# Altium schematic sheet INV.ControlMCU.SchDoc
size A0; SheetNumber: 3; SheetTotal: 3
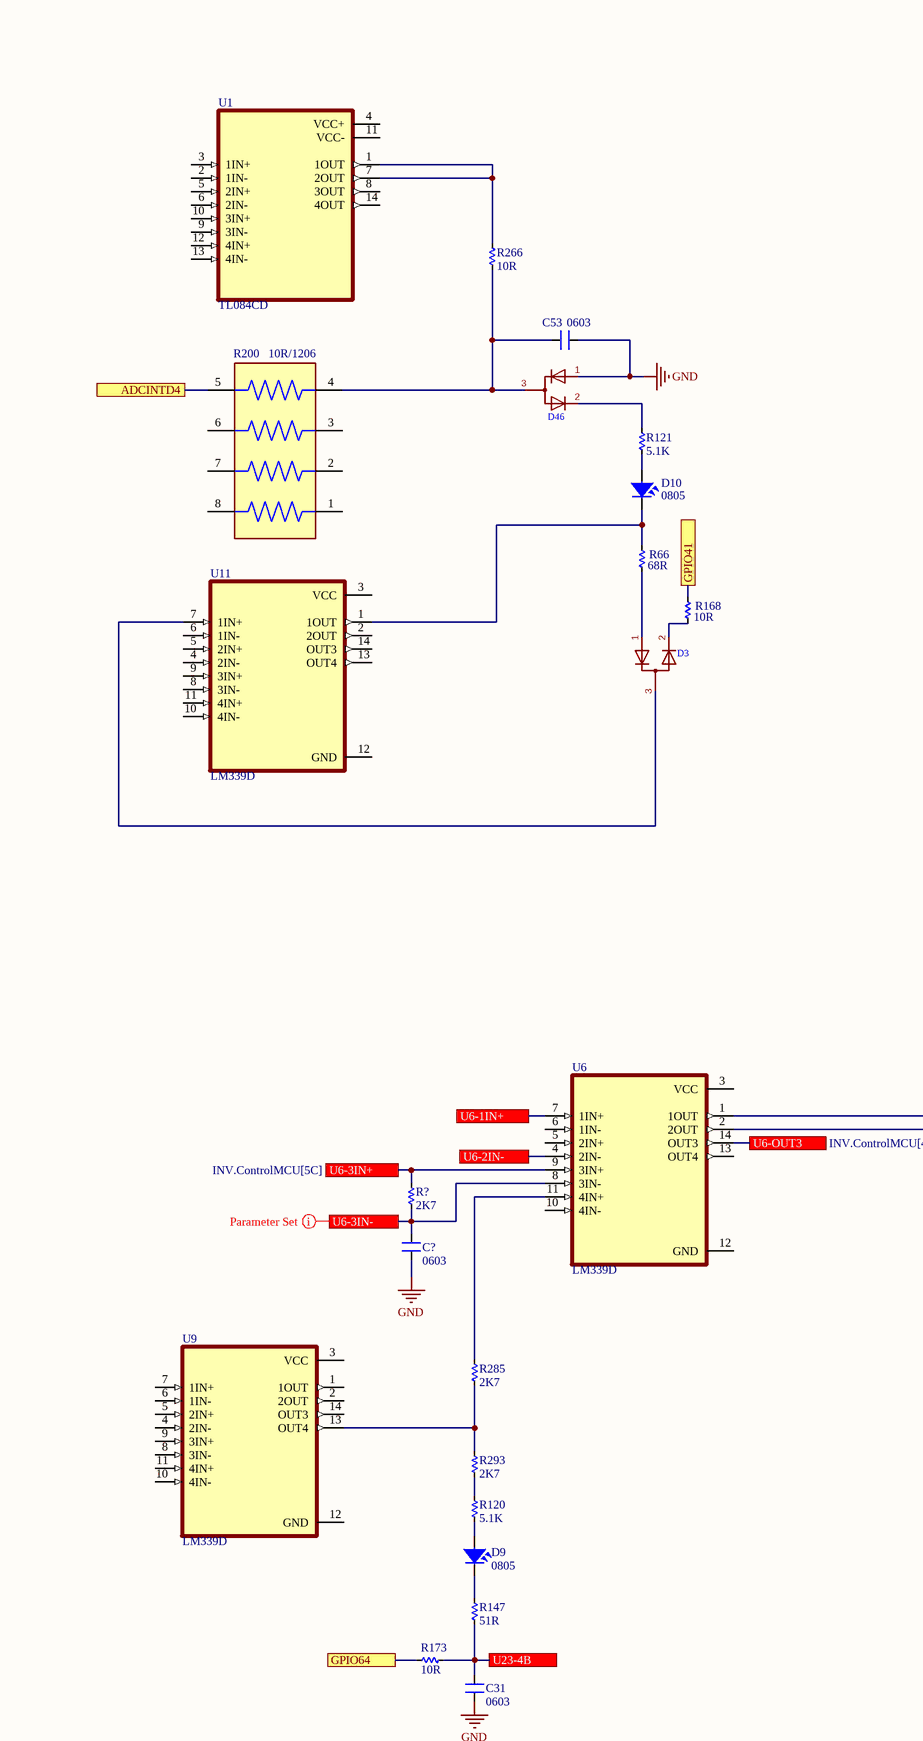
[diagram p0: INV.ControlMCU.SchDoc, top left]
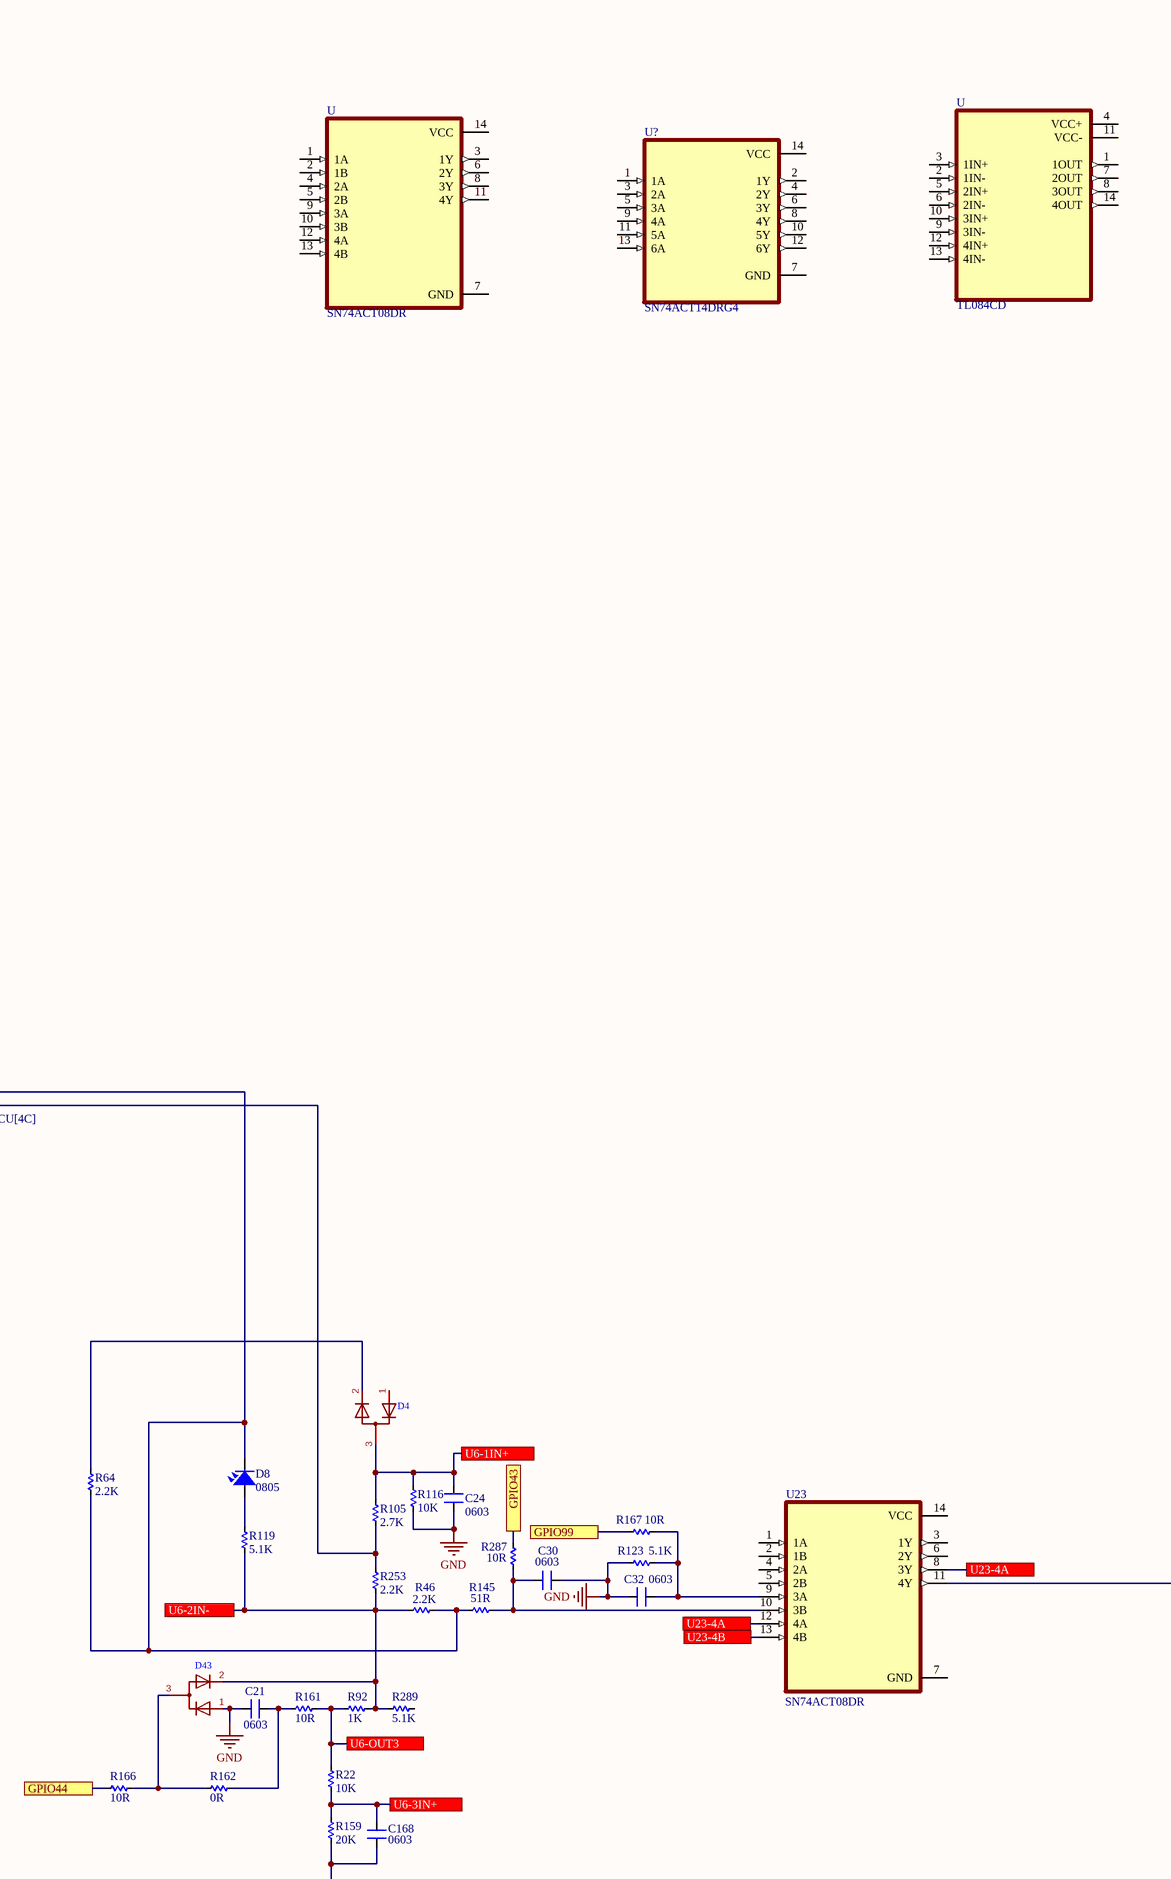
[diagram p1: INV.ControlMCU.SchDoc, top middle]
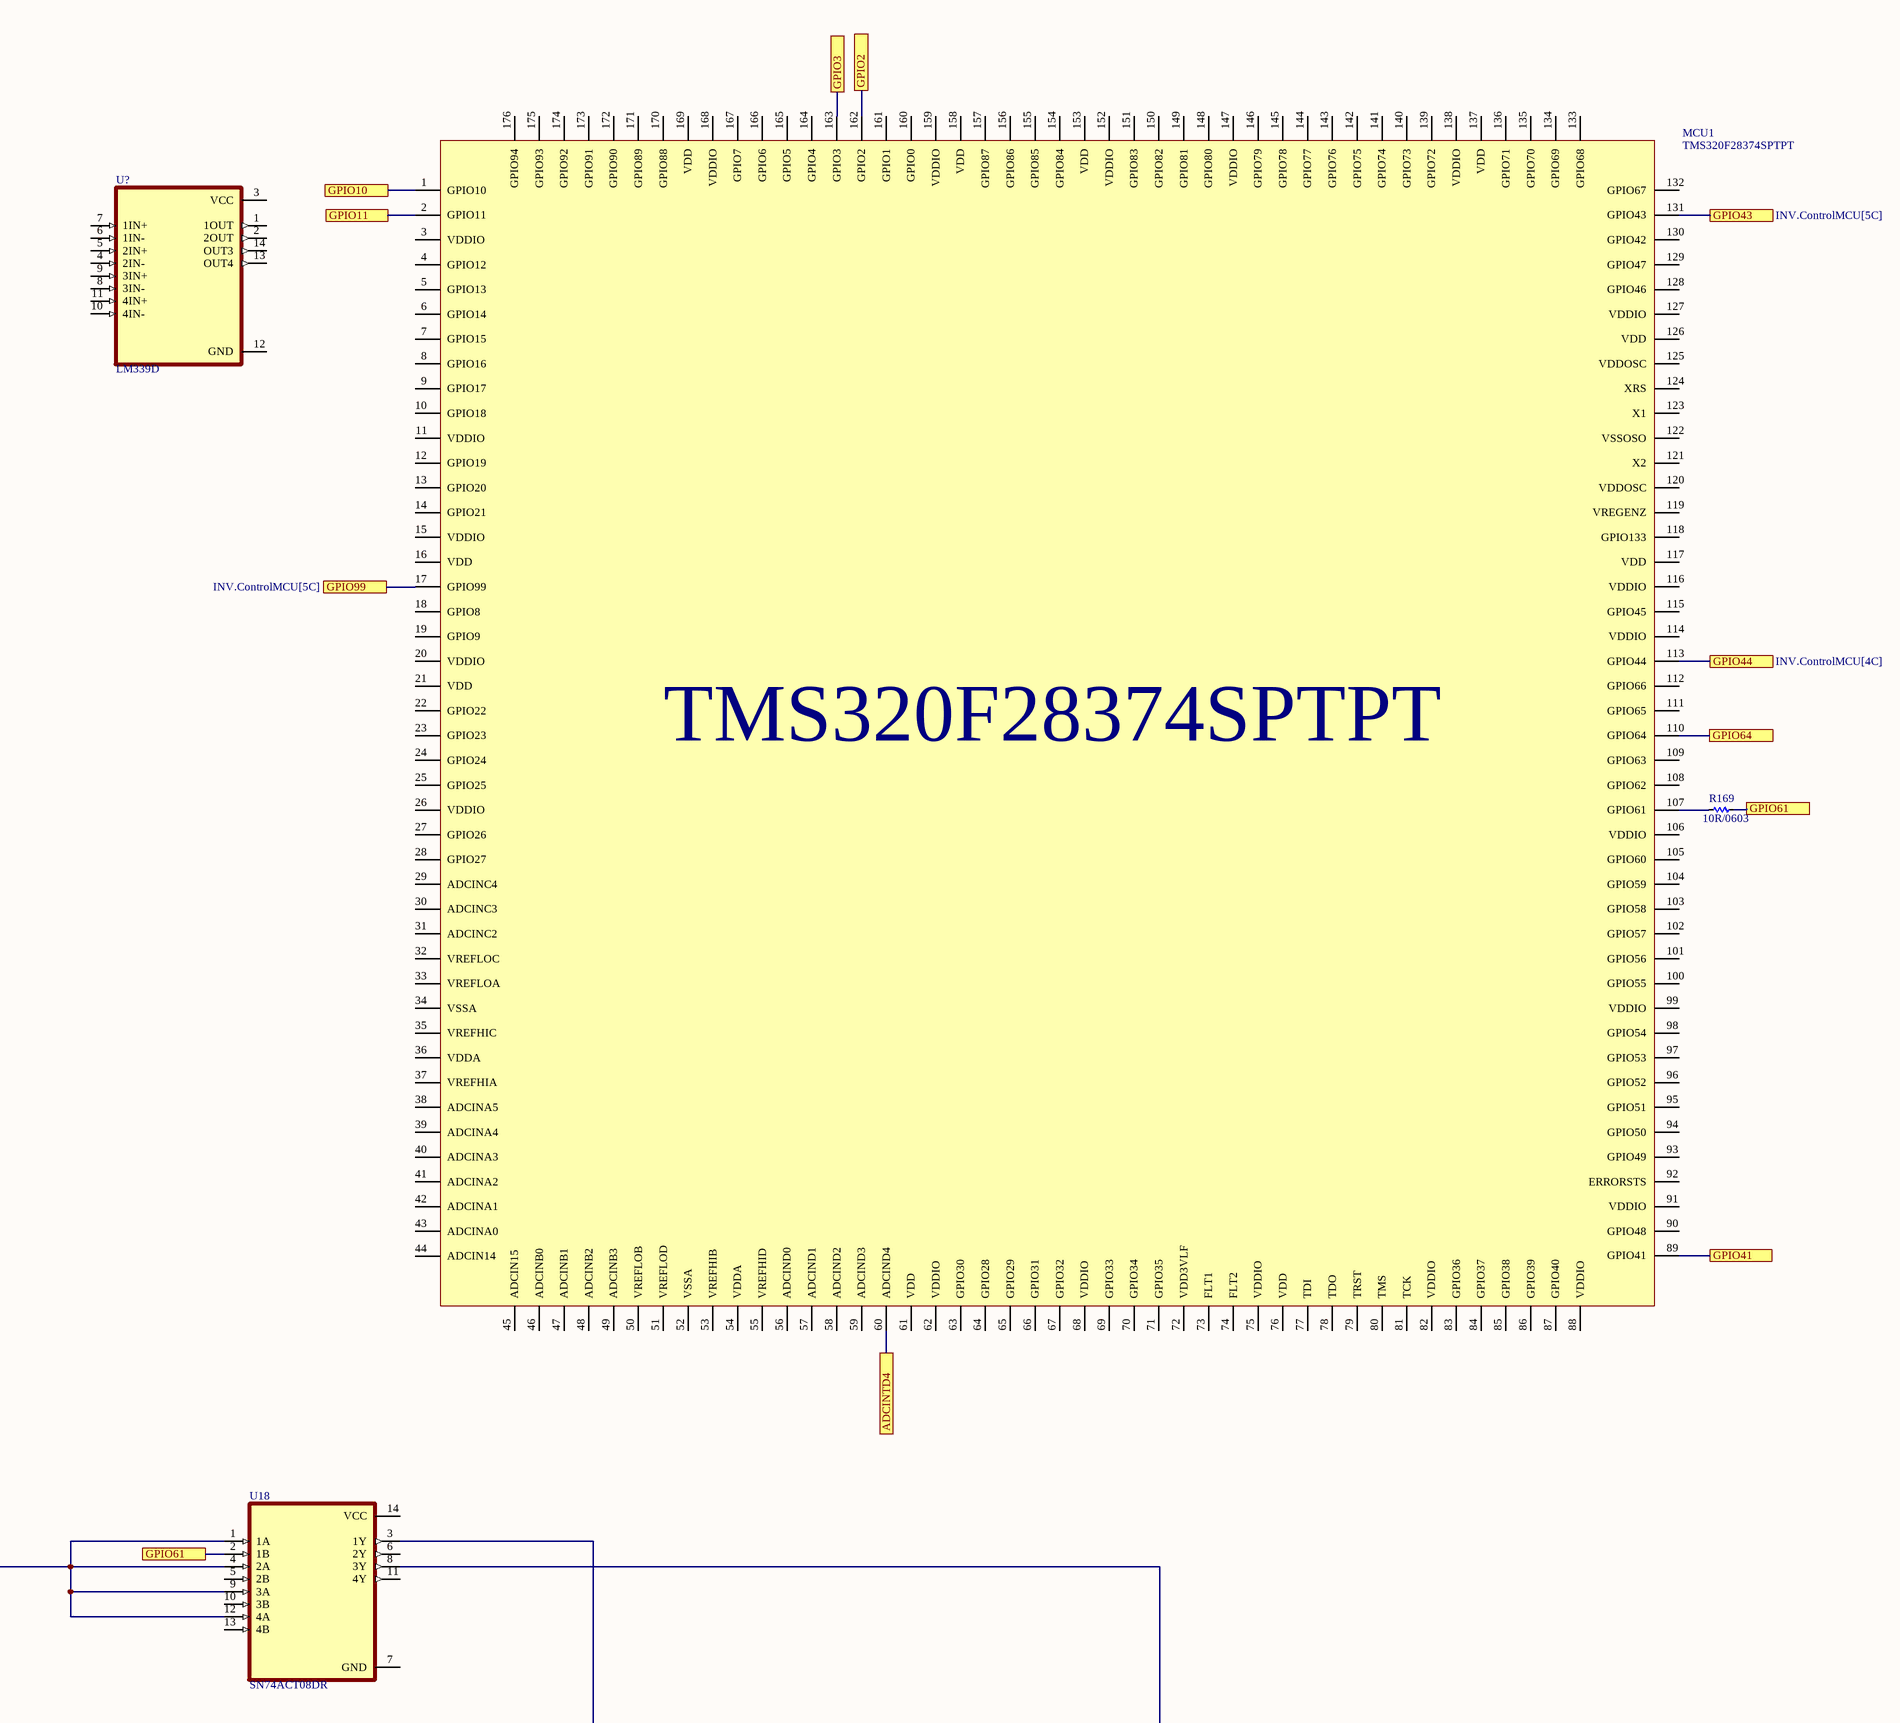
[diagram p2: INV.ControlMCU.SchDoc, top right]
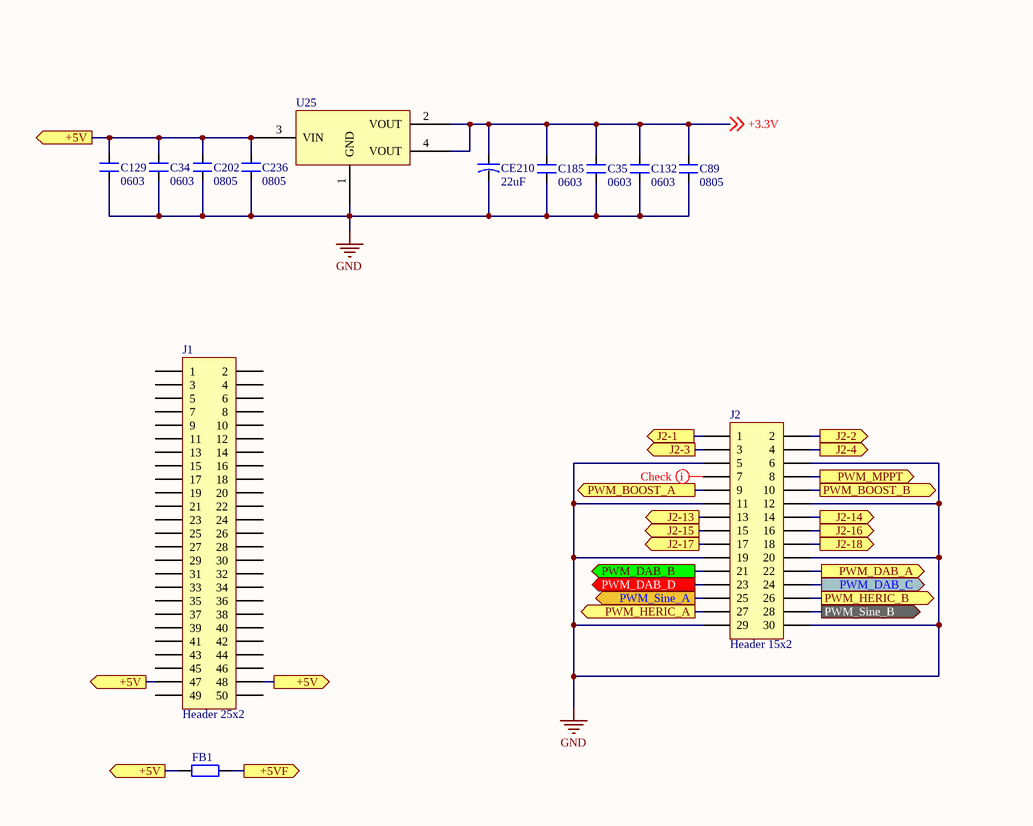
[diagram p3: INV.ControlMCU.SchDoc, bottom left]
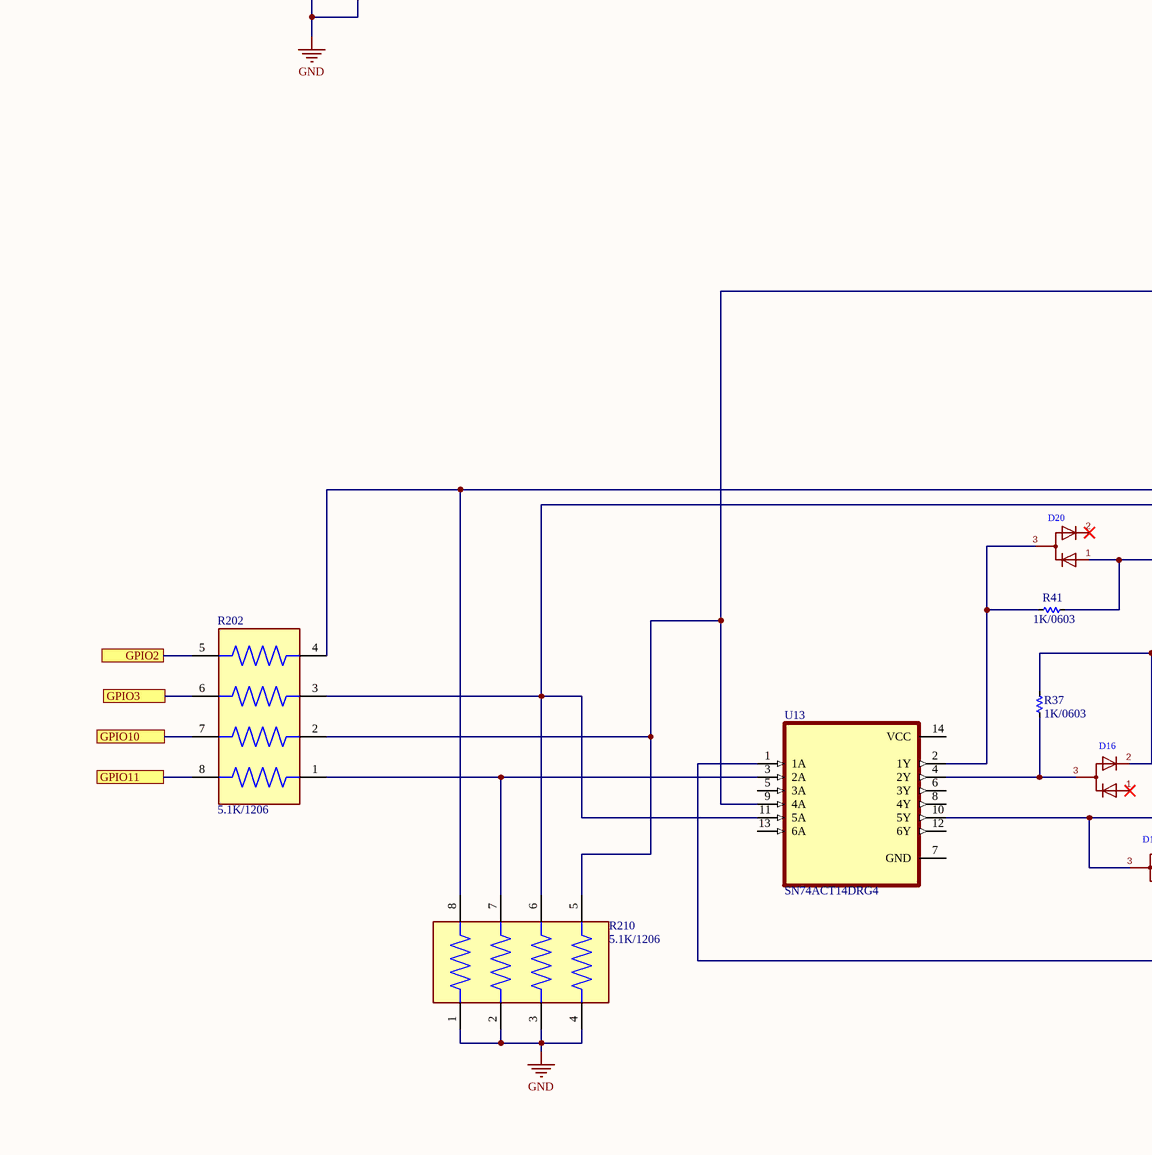
[diagram p4: INV.ControlMCU.SchDoc, bottom middle]
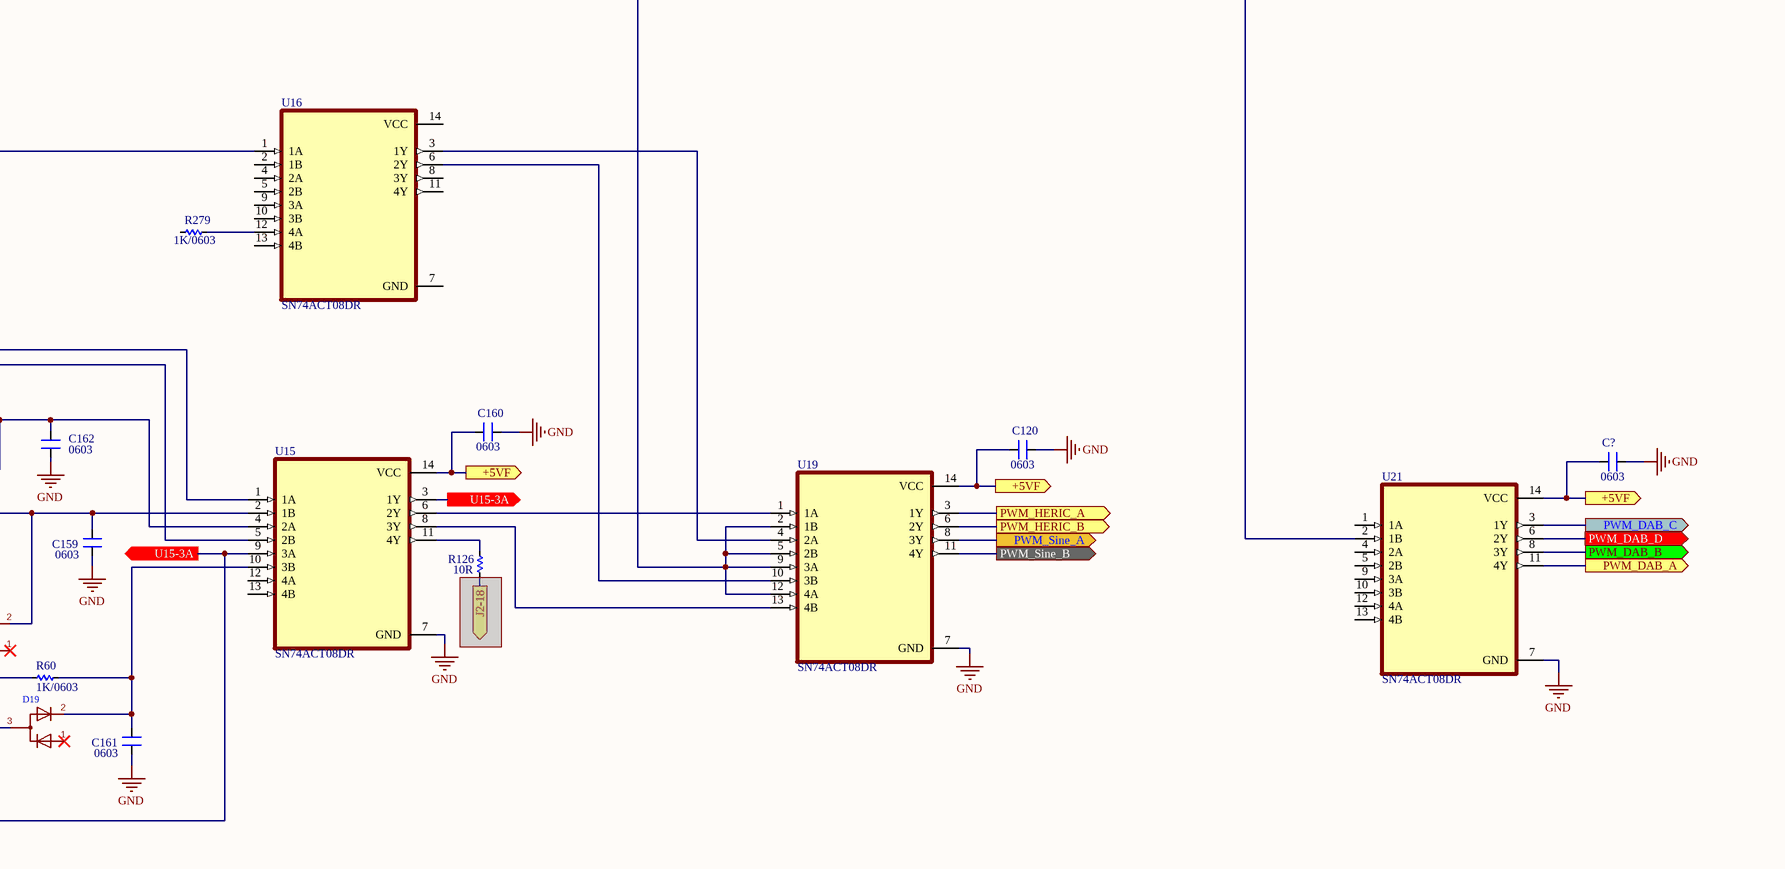
[diagram p5: INV.ControlMCU.SchDoc, bottom right]

## Parts
(Parts that share a designator on the sheet are numbered #1, #2 ... from top to bottom, then left to right.)
C21  0603  [CAP-SMD-0805 EX]
C24  0603  [CAP-SMD-0805 EX]
C30  0603  [CAP-SMD-0805 EX]
C31  0603  [CAP-SMD-0805 EX]
C32  0603  [CAP-SMD-0805 EX]
C34  0603  [CAP-SMD-0805 EX]
C35  0603  [CAP-SMD-0805 EX]
C53  0603  [CAP-SMD-0805 EX]
C89  0805  [CAP-SMD-0805 EX]
C120  0603  [CAP-SMD-0805 EX]
C129  0603  [CAP-SMD-0805 EX]
C132  0603  [CAP-SMD-0805 EX]
C159  0603  [CAP-SMD-0805 EX]
C160  0603  [CAP-SMD-0805 EX]
C161  0603  [CAP-SMD-0805 EX]
C162  0603  [CAP-SMD-0805 EX]
C168  0603  [CAP-SMD-0805 EX]
C185  0603  [CAP-SMD-0805 EX]
C202  0805  [CAP-SMD-0805 EX]
C236  0805  [CAP-SMD-0805 EX]
C?#1  0603  [CAP-SMD-0805 EX]
C?#2  0603  [CAP-SMD-0805 EX]
CE210  22uF  [CAP-ALU-SMD-4]
D3  Dual-Diode_CA_1  [SOT-23]  (value not drawn)
D4  Dual-Diode_CA_1  [SOT-23]  (value not drawn)
D8  0805  [LED 3512]
D9  0805  [LED 3512]
D10  0805  [LED 3512]
D16  Dual-Diode_CA_1  [SOT-23]  (value not drawn)
D19  Dual-Diode_CA_1  [SOT-23]  (value not drawn)
D20  Dual-Diode_CA_1  [SOT-23]  (value not drawn)
D43  Dual-Diode_CA_1  [SOT-23]  (value not drawn)
D46  Dual-Diode_CA_1  [SOT-23]  (value not drawn)
FB1  (no value)  [RESC-0603 (1608)]
J1  Header 25x2  [Head 1X16 - CAI THANG]
J2  Header 15x2  [Head 1X16 - CAI THANG]
MCU1  TMS320F28374SPTPT
R22  10K  [RES-SMD-0603 EX]
R37  1K/0603  [RES-SMD-0603]
R41  1K/0603  [RES-SMD-0603]
R46  2.2K  [RES-SMD-0603 EX]
R60  1K/0603  [RES-SMD-0603]
R64  2.2K  [RES-SMD-0603 EX]
R66  68R  [RES-SMD-0603 EX]
R92  1K  [RES-SMD-0603 EX]
R105  2.7K  [RES-SMD-0603 EX]
R116  10K  [RES-SMD-0603 EX]
R119  5.1K  [RES-SMD-0603 EX]
R120  5.1K  [RES-SMD-0603 EX]
R121  5.1K  [RES-SMD-0603 EX]
R123  5.1K  [RES-SMD-0603 EX]
R126  10R  [RES-1/2W]
R145  51R  [RES-SMD-0603 EX]
R147  51R  [RES-SMD-0603 EX]
R159  20K  [RES-SMD-0603 EX]
R161  10R  [RES-SMD-0603 EX]
R162  0R  [RES-SMD-0603 EX]
R166  10R  [RES-SMD-0603 EX]
R167  10R  [RES-SMD-0603 EX]
R168  10R  [RES-SMD-0603 EX]
R169  10R/0603  [RES-SMD-0603 EX]
R173  10R  [RES-SMD-0603 EX]
R200  10R/1206  [RESCAXS80P320X150X55-8N]
R202  5.1K/1206  [RESCAXS80P320X150X55-8N]
R210  5.1K/1206  [RESCAXS80P320X150X55-8N]
R253  2.2K  [RES-SMD-0603 EX]
R266  10R  [RES-SMD-0603 EX]
R279  1K/0603  [RES-SMD-0603]
R285  2K7  [RES-SMD-0603 EX]
R287  10R  [RES-SMD-0603 EX]
R289  5.1K  [RES-SMD-0603 EX]
R293  2K7  [RES-SMD-0603 EX]
R?  2K7  [RES-SMD-0603 EX]
U1  TL084CD  [SOIC127P600X175-14N]
U6  LM339D  [SOIC127P600X175-14N]
U9  LM339D  [SOIC127P600X175-14N]
U11  LM339D  [SOIC127P600X175-14N]
U13  SN74ACT14DRG4  [SOIC127P600X175-14N]
U15  SN74ACT08DR  [SOIC127P600X175-14N]
U16  SN74ACT08DR  [SOIC127P600X175-14N]
U18  SN74ACT08DR  [SOIC127P600X175-14N]
U19  SN74ACT08DR  [SOIC127P600X175-14N]
U21  SN74ACT08DR  [SOIC127P600X175-14N]
U23  SN74ACT08DR  [SOIC127P600X175-14N]
U25  LM1117B  [SOT223]  (value not drawn)
U#1  TL084CD  [SOIC127P600X175-14N]
U#2  SN74ACT08DR  [SOIC127P600X175-14N]
U?#1  LM339D  [SOIC127P600X175-14N]
U?#2  SN74ACT14DRG4  [SOIC127P600X175-14N]

## Ports
+5V (out, see INV.ControlMCU[1D], INV.Main[1D], INV.Main[3A], INV.Main[3D], INV.Main[4A], INV.Power[1D], INV.Power[6C]), +5VF (out, see INV.ControlMCU[1D], INV.ControlMCU[8C], INV.ControlMCU[9C], INV.Main[1D], INV.Main[3D]), +5VF (out, see INV.ControlMCU[1D], INV.ControlMCU[8C], INV.ControlMCU[11C], INV.Main[1D], INV.Main[3D]), +5VF (out, see INV.ControlMCU[1D], INV.ControlMCU[9C], INV.ControlMCU[11C], INV.Main[1D], INV.Main[3D]), +5VF (out, see INV.ControlMCU[8C], INV.ControlMCU[9C], INV.ControlMCU[11C], INV.Main[1D], INV.Main[3D]), ADCINTD4 (see INV.ControlMCU[1A]), ADCINTD4 (see INV.ControlMCU[9B]), GPIO2 (see INV.ControlMCU[4C]), GPIO2 (see INV.ControlMCU[9A]), GPIO3 (see INV.ControlMCU[4D]), GPIO3 (see INV.ControlMCU[9A]), GPIO10 (see INV.ControlMCU[4D]), GPIO10 (see INV.ControlMCU[7A]), GPIO11 (see INV.ControlMCU[4D]), GPIO11 (see INV.ControlMCU[7A]), GPIO41 (see INV.ControlMCU[3B]), GPIO41 (see INV.ControlMCU[11B]), GPIO43 (see INV.ControlMCU[5C]), GPIO43 (see INV.ControlMCU[11A]), GPIO44 (see INV.ControlMCU[4C]), GPIO44 (see INV.ControlMCU[11B]), GPIO61 (see INV.ControlMCU[7C]), GPIO61 (see INV.ControlMCU[11B]), GPIO64 (see INV.ControlMCU[2C]), GPIO64 (see INV.ControlMCU[11B]), GPIO99 (see INV.ControlMCU[5C]), GPIO99 (see INV.ControlMCU[7B]), J2-1 (out, see INV.Main[1D]), J2-2 (out, see INV.Main[1D]), J2-3 (out, see INV.Main[1D]), J2-4 (out, see INV.Main[1D]), J2-13 (out, see INV.Main[1D]), J2-14 (out, see INV.Main[1D]), J2-15 (out, see INV.Main[1D]), J2-16 (out, see INV.Main[1D]), J2-17 (out, see INV.Main[1D]), J2-18 (out, see INV.ControlMCU[3D], INV.Main[1D]), J2-18 (out, see INV.Main[1D]), PWM_BOOST_A (out, see INV.Main[1D], INV.Main[2B]), PWM_BOOST_B (out, see INV.Main[1D], INV.Main[3B]), PWM_DAB_A (out, see INV.ControlMCU[3D], INV.Main[1B], INV.Main[1D]), PWM_DAB_A (out, see INV.ControlMCU[11D], INV.Main[1B], INV.Main[1D]), PWM_DAB_B (out, see INV.ControlMCU[2D], INV.Main[1B], INV.Main[1D]), PWM_DAB_B (out, see INV.ControlMCU[11C], INV.Main[1B], INV.Main[1D]), PWM_DAB_C (out, see INV.ControlMCU[3D], INV.Main[1D], INV.Main[2B]), PWM_DAB_C (out, see INV.ControlMCU[11C], INV.Main[1D], INV.Main[2B]), PWM_DAB_D (out, see INV.ControlMCU[2D], INV.Main[1D], INV.Main[2B]), PWM_DAB_D (out, see INV.ControlMCU[11C], INV.Main[1D], INV.Main[2B]), PWM_HERIC_A (out, see INV.ControlMCU[2D], INV.Main[1D], INV.Main[4B]), PWM_HERIC_A (out, see INV.ControlMCU[9C], INV.Main[1D], INV.Main[4B]), PWM_HERIC_B (out, see INV.ControlMCU[3D], INV.Main[1D], INV.Main[4B]), PWM_HERIC_B (out, see INV.ControlMCU[9C], INV.Main[1D], INV.Main[4B]), PWM_MPPT (out, see INV.Main[1D], INV.Main[4D]), PWM_Sine_A (out, see INV.ControlMCU[2D], INV.Main[1D], INV.Main[3B]), PWM_Sine_A (out, see INV.ControlMCU[9C], INV.Main[1D], INV.Main[3B]), PWM_Sine_B (out, see INV.ControlMCU[3D], INV.Main[1D], INV.Main[3B]), PWM_Sine_B (out, see INV.ControlMCU[9D], INV.Main[1D], INV.Main[3B]), U6-1IN+ (see INV.ControlMCU[2B]), U6-1IN+ (see INV.ControlMCU[5B]), U6-2IN- (see INV.ControlMCU[2B]), U6-2IN- (see INV.ControlMCU[4C]), U6-3IN+ (see INV.ControlMCU[2B]), U6-3IN+ (see INV.ControlMCU[5C]), U6-3IN-, U6-OUT3 (see INV.ControlMCU[3B]), U6-OUT3 (see INV.ControlMCU[4C]), U15-3A (out, see INV.ControlMCU[7D]), U15-3A (out, see INV.ControlMCU[8C]), U23-4A (see INV.ControlMCU[5C]), U23-4A (see INV.ControlMCU[6C]), U23-4B (see INV.ControlMCU[2C]), U23-4B (see INV.ControlMCU[5C])

## Nets
GND: C21.2 C24.2 C30.1 C31.1 C32.2 C34.1 C35.1 C53.1 C89.1 C120.1 C129.1 C132.1 C159.1 C160.1 C161.1 C162.1 C168.2 C185.1 C202.1 C236.1 C?#1.1 C?#2.1 CE210.2 D43.1(C) D46.1(C) J2.5 J2.6 J2.11 J2.12 J2.19 J2.20 J2.29 J2.30 R116.1 R123.2 R159.1 R210.1 R210.2 R210.3 R210.4 U15.7(GND) U19.7(GND) U21.7(GND) U25.1(GND)
+3.3V: C35.2 C89.2 C132.2 C185.2 CE210.1 U25.2(VOUT) U25.4(VOUT) ; off-sheet +3.3V
+5V: C34.2 C129.2 C202.2 C236.2 FB1.1 J1.47 J1.48 U25.3(VIN) ; port +5V
+5VF: C120.2 C160.2 C?#2.2 FB1.2 U15.14(VCC) U19.14(VCC) U21.14(VCC) ; port +5VF
ADCINTD4: MCU1.60(ADCIND4) R200.5 ; port ADCINTD4
GPIO2: MCU1.162(GPIO2) R202.5 ; port GPIO2
GPIO3: MCU1.163(GPIO3) R202.6 ; port GPIO3
GPIO10: MCU1.1(GPIO10) R202.7 ; port GPIO10
GPIO11: MCU1.2(GPIO11) R202.8 ; port GPIO11
GPIO41: MCU1.89(GPIO41) R168.1 ; port GPIO41
GPIO43: MCU1.131(GPIO43) R287.2 ; port GPIO43
GPIO44: MCU1.113(GPIO44) R166.1 ; port GPIO44
GPIO61: R169.1 U18.2(1B) ; port GPIO61
GPIO64: MCU1.110(GPIO64) R173.2 ; port GPIO64
GPIO99: MCU1.17(GPIO99) R167.2 ; port GPIO99
J2-1: J2.1 ; port J2-1
J2-2: J2.2 ; port J2-2
J2-3: J2.3 ; port J2-3
J2-4: J2.4 ; port J2-4
J2-13: J2.13 ; port J2-13
J2-14: J2.14 ; port J2-14
J2-15: J2.15 ; port J2-15
J2-16: J2.16 ; port J2-16
J2-17: J2.17 ; port J2-17
J2-18: J2.18 ; port J2-18
PWM_BOOST_A: J2.9 ; port PWM_BOOST_A
PWM_BOOST_B: J2.10 ; port PWM_BOOST_B
PWM_DAB_A: J2.22 U21.11(4Y) ; port PWM_DAB_A
PWM_DAB_B: J2.21 U21.8(3Y) ; port PWM_DAB_B
PWM_DAB_C: J2.24 U21.3(1Y) ; port PWM_DAB_C
PWM_DAB_D: J2.23 U21.6(2Y) ; port PWM_DAB_D
PWM_HERIC_A: J2.27 U19.3(1Y) ; port PWM_HERIC_A
PWM_HERIC_B: J2.26 U19.6(2Y) ; port PWM_HERIC_B
PWM_MPPT: J2.8 ; port PWM_MPPT
PWM_Sine_A: J2.25 U19.8(3Y) ; port PWM_Sine_A
PWM_Sine_B: J2.28 U19.11(4Y) ; port PWM_Sine_B
U6-1IN+: C24.1 D4.3(A) R105.1 R116.2 U6.7(1IN+) ; port U6-1IN+
U6-2IN-: D43.2(C) R46.2 R92.2 R119.1 R253.2 R289.2 U6.4(2IN-) ; port U6-2IN-
U6-3IN+: C168.1 R22.1 R159.2 R?.2 U6.9(3IN+) ; port U6-3IN+
U6-3IN-: C?#1.2 R?.1 U6.8(3IN-) ; port U6-3IN-
U6-OUT3: R22.2 R92.1 R161.2 U6.14(OUT3) ; port U6-OUT3
U15-3A: U13.1(1A) U15.3(1Y) U15.9(3A) ; port U15-3A
U23-4A: U23.8(3Y) U23.12(4A) ; port U23-4A
U23-4B: C31.2 R147.1 R173.1 U23.13(4B) ; port U23-4B
NetC21_1: C21.1 R161.1 R162.2
NetC30_2: C30.2 R145.1 R287.1 U23.10(3B)
NetC32_1: C32.1 R123.1 R167.1 U23.9(3A)
NetC53_2: C53.2 D46.3(A) R200.4 R266.1
NetC159_2: C159.2 D16.2(C) R37.1 U15.2(1B)
NetC161_2: C161.2 D19.2(C) R60.2 U15.10(3B)
NetC162_2: C162.2 D20.1(C) R41.2 U15.4(2A)
NetD3_1: D3.1(C) R66.2
NetD3_2: D3.2(C) R168.2
NetD3_3: D3.3(A) U11.7(1IN+)
NetD4_2: D4.2(C) R64.2
NetD8_1: D8.1 R119.2
NetD8_2: D8.2 R46.1 R64.1 R145.2 U6.1(1OUT)
NetD9_1: D9.1 R120.2
NetD9_2: D9.2 R147.2
NetD10_1: D10.1 R121.2
NetD10_2: D10.2 R66.1 U11.1(1OUT)
NetD16_3: D16.3(A) R37.2 U13.4(2Y)
NetD19_3: D19.3(A) R60.1 U13.10(5Y)
NetD20_3: D20.3(A) R41.1 U13.2(1Y)
NetD43_3: D43.3(A) R162.1 R166.2
NetD46_2: D46.2(C) R121.1
NetMCU1_107: MCU1.107(GPIO61) R169.2
NetR105_2: R105.2 R253.1 U6.2(2OUT)
NetR120_1: R120.1 R293.2
NetR126_1: R126.1 U15.11(4Y)
NetR202_1: R202.1 R210.7 U13.3(2A)
NetR202_2: R202.2 R210.5 U13.9(4A) U16.1(1A)
NetR202_3: R202.3 R210.6 U13.11(5A) U15.5(2B)
NetR202_4: R202.4 R210.8 U15.1(1A)
NetR266_2: R266.2 U1.1(1OUT) U1.7(2OUT)
NetR279_2: R279.2 U16.12(4A)
NetR285_1: R285.1 R293.1 U9.13(OUT4)
NetR285_2: R285.2 U6.11(4IN+)
NetU15_6: U15.6(2Y) U19.1(1A)
NetU15_8: U15.8(3Y) U19.13(4B)
NetU16_3: U16.3(1Y) U19.4(2A)
NetU16_6: U16.6(2Y) U19.10(3B)
NetU18_1: U18.1(1A) U18.4(2A) U18.9(3A) U18.12(4A) U23.11(4Y)
NetU18_3: U18.3(1Y) U19.2(1B) U19.5(2B) U19.9(3A) U19.12(4A)
NetU18_8: U18.8(3Y) U21.2(1B)

Not connected (* = marked no-connect by the designer): D4 1(C); D16 1(C)*; D19 1(C)*; D20 2(C)*; J1 1 2 3 4 5 6 7 8 9 10 11 12 13 14 15 16 17 18 19 20 21 22 23 24 25 26 27 28 29 30 31 32 33 34 35 36 37 38 39 40 41 42 43 44 45 46 49 50; J2 7; MCU1 3(VDDIO) 4(GPIO12) 5(GPIO13) 6(GPIO14) 7(GPIO15) 8(GPIO16) 9(GPIO17) 10(GPIO18) 11(VDDIO) 12(GPIO19) 13(GPIO20) 14(GPIO21) 15(VDDIO) 16(VDD) 18(GPIO8) 19(GPIO9) 20(VDDIO) 21(VDD) 22(GPIO22) 23(GPIO23) 24(GPIO24) 25(GPIO25) 26(VDDIO) 27(GPIO26) 28(GPIO27) 29(ADCINC4) 30(ADCINC3) 31(ADCINC2) 32(VREFLOC) 33(VREFLOA) 34(VSSA) 35(VREFHIC) 36(VDDA) 37(VREFHIA) 38(ADCINA5) 39(ADCINA4) 40(ADCINA3) 41(ADCINA2) 42(ADCINA1) 43(ADCINA0) 44(ADCIN14) 45(ADCIN15) 46(ADCINB0) 47(ADCINB1) 48(ADCINB2) 49(ADCINB3) 50(VREFLOB) 51(VREFLOD) 52(VSSA) 53(VREFHIB) 54(VDDA) 55(VREFHID) 56(ADCIND0) 57(ADCIND1) 58(ADCIND2) 59(ADCIND3) 61(VDD) 62(VDDIO) 63(GPIO30) 64(GPIO28) 65(GPIO29) 66(GPIO31) 67(GPIO32) 68(VDDIO) 69(GPIO33) 70(GPIO34) 71(GPIO35) 72(VDD3VLF) 73(FLT1) 74(FLT2) 75(VDDIO) 76(VDD) 77(TDI) 78(TDO) 79(TRST) 80(TMS) 81(TCK) 82(VDDIO) 83(GPIO36) 84(GPIO37) 85(GPIO38) 86(GPIO39) 87(GPIO40) 88(VDDIO) 90(GPIO48) 91(VDDIO) 92(ERRORSTS) 93(GPIO49) 94(GPIO50) 95(GPIO51) 96(GPIO52) 97(GPIO53) 98(GPIO54) 99(VDDIO) 100(GPIO55) 101(GPIO56) 102(GPIO57) 103(GPIO58) 104(GPIO59) 105(GPIO60) 106(VDDIO) 108(GPIO62) 109(GPIO63) 111(GPIO65) 112(GPIO66) 114(VDDIO) 115(GPIO45) 116(VDDIO) 117(VDD) 118(GPIO133) 119(VREGENZ) 120(VDDOSC) 121(X2) 122(VSSOSO) 123(X1) 124(XRS) 125(VDDOSC) 126(VDD) 127(VDDIO) 128(GPIO46) 129(GPIO47) 130(GPIO42) 132(GPIO67) 133(GPIO68) 134(GPIO69) 135(GPIO70) 136(GPIO71) 137(VDD) 138(VDDIO) 139(GPIO72) 140(GPIO73) 141(GPIO74) 142(GPIO75) 143(GPIO76) 144(GPIO77) 145(GPIO78) 146(GPIO79) 147(VDDIO) 148(GPIO80) 149(GPIO81) 150(GPIO82) 151(GPIO83) 152(VDDIO) 153(VDD) 154(GPIO84) 155(GPIO85) 156(GPIO86) 157(GPIO87) 158(VDD) 159(VDDIO) 160(GPIO0) 161(GPIO1) 164(GPIO4) 165(GPIO5) 166(GPIO6) 167(GPIO7) 168(VDDIO) 169(VDD) 170(GPIO88) 171(GPIO89) 172(GPIO90) 173(GPIO91) 174(GPIO92) 175(GPIO93) 176(GPIO94); R126 2; R200 1 2 3 6 7 8; R279 1; R289 1; U1 2(1IN-) 3(1IN+) 4(VCC+) 5(2IN+) 6(2IN-) 8(3OUT) 9(3IN-) 10(3IN+) 11(VCC-) 12(4IN+) 13(4IN-) 14(4OUT); U6 3(VCC) 5(2IN+) 6(1IN-) 10(4IN-) 12(GND) 13(OUT4); U9 1(1OUT) 2(2OUT) 3(VCC) 4(2IN-) 5(2IN+) 6(1IN-) 7(1IN+) 8(3IN-) 9(3IN+) 10(4IN-) 11(4IN+) 12(GND) 14(OUT3); U11 2(2OUT) 3(VCC) 4(2IN-) 5(2IN+) 6(1IN-) 8(3IN-) 9(3IN+) 10(4IN-) 11(4IN+) 12(GND) 13(OUT4) 14(OUT3); U13 5(3A) 6(3Y) 7(GND) 8(4Y) 12(6Y) 13(6A) 14(VCC); U15 12(4A) 13(4B); U16 2(1B) 4(2A) 5(2B) 7(GND) 8(3Y) 9(3A) 10(3B) 11(4Y) 13(4B) 14(VCC); U18 5(2B) 6(2Y) 7(GND) 10(3B) 11(4Y) 13(4B) 14(VCC); U21 1(1A) 4(2A) 5(2B) 9(3A) 10(3B) 12(4A) 13(4B); U23 1(1A) 2(1B) 3(1Y) 4(2A) 5(2B) 6(2Y) 7(GND) 14(VCC); U#1 1(1OUT) 2(1IN-) 3(1IN+) 4(VCC+) 5(2IN+) 6(2IN-) 7(2OUT) 8(3OUT) 9(3IN-) 10(3IN+) 11(VCC-) 12(4IN+) 13(4IN-) 14(4OUT); U#2 1(1A) 2(1B) 3(1Y) 4(2A) 5(2B) 6(2Y) 7(GND) 8(3Y) 9(3A) 10(3B) 11(4Y) 12(4A) 13(4B) 14(VCC); U?#1 1(1OUT) 2(2OUT) 3(VCC) 4(2IN-) 5(2IN+) 6(1IN-) 7(1IN+) 8(3IN-) 9(3IN+) 10(4IN-) 11(4IN+) 12(GND) 13(OUT4) 14(OUT3); U?#2 1(1A) 2(1Y) 3(2A) 4(2Y) 5(3A) 6(3Y) 7(GND) 8(4Y) 9(4A) 10(5Y) 11(5A) 12(6Y) 13(6A) 14(VCC)

## Layout directives
mark named Check: NetJ2_7

## Library data of the parts
C21 C24 C30-C32 C34 C35 C53 C89 C120 C129 C132 C159-C162 C168 C185 C202 C236 C?#1 C?#2 = CAP-SMD: Value: 33pF
CE210 = CAP-ALU-SMD: Published: 8-Jun-2000; LatestRevisionDate: 17-Jul-2002; LatestRevisionNote: Re-released for DXP Platform.; PackageReference: POLAR0.8; Publisher: Altium Limited
D3 D4 D16 D19 D20 D43 D46 = Dual-Diode_CA_1: BAT54S thay the BAV99:A7; ki_keywords: Dual Diode Common Anode; Value: Dual_Diode_CA; Reference: D; ki_description: Dual Diode Common Anode
D8-D10 = LED1-SMD: Value: LED 3 - 5 ly 2 Colour
FB1 = RC0603FR-0775RL: RES SMD 75 OHM 1% 1/10W 0603; Solder: SMT; Value: 75R; MPN: RC0603FR-0775RL; Category: RESISTOR; PinCount: 2
J1 = Header 25x2: Header, 25x2-Pin 2.5mm; LatestRevisionDate: 17-Jul-2002; LatestRevisionNote: Re-released for DXP Platform.; Publisher: Altium Limited
J2 = Header 15x2: Header, 15x2-Pin 2.5mm; LatestRevisionDate: 17-Jul-2002; LatestRevisionNote: Re-released for DXP Platform.; Publisher: Altium Limited
R22 R37 R41 R46 R60 R64 R66 R92 R105 R119-R121 R123 R145 R147 R159 R161 R162 R166-R169 R173 R253 R266 R279 R285 R287 R289 R293 R? = Res-SMD: Resistor; Manufacturer: Generic Components; Class: Passive; Published: 08/06/2000; Publisher: Altium Hobart Technology Centre
R116 = Res-SMD: 0603; Manufacturer: Generic Components; Class: Passive; Published: 08/06/2000; Publisher: Altium Hobart Technology Centre
R126 = Res: Manufacturer: Generic Components; Class: Passive; SubClass: R; Published: 08/06/2000; Publisher: Altium Hobart Technology Centre
R200 R202 R210 = Network Resistor: MF: {'manufacturer': u'Vishay Beyschlag'}; MP: ACASA1002S1002P1AT; Package: None; Price: None; Value: *; Availability: Unavailable
U1 U#1 = TL084CD: Quad High Slew Rate JFET-Input Operational Amplifier 14-SOIC 0 to 70; MF: Texas Instruments; DigiKey-Purchase-URL: https://snapeda.com/shop?store=DigiKey&id=139348; Package: SOIC-14 Texas Instruments; Mouser-Purchase-URL: https://snapeda.com/shop?store=Mouser&id=139348; MP: TL084CD; Value: *; SnapEDA_Link: https://www.snapeda.com/parts/TL084CD/Texas%20Instruments/view-part/139348/?ref=snap; Digi-Key_Part_Number: 296-1285-2-ND; BuyPart: https://www.snapeda.com/parts/TL084CD/Texas%20Instruments/view-part/139348/?ref=eda
U13 U?#2 = SN74ACT14DRG4: Hex Schmitt-Trigger Inverters 14-SOIC -40 to 85; MF: Texas Instruments; SnapEDA_Link: https://www.snapeda.com/parts/SN74ACT14DRG4/Texas+Instruments/view-part/?ref=snap; Package: SOIC-14 Texas Instruments; Value: *; MP: SN74ACT14DRG4; Check_prices: https://www.snapeda.com/parts/SN74ACT14DRG4/Texas+Instruments/view-part/?ref=eda
U15 U16 U18 U19 U21 U23 U#2 = SN74ACT08DR: Quadruple 2-Input Positive-AND Gates 14-SOIC -40 to 85; MF: Texas Instruments; Mouser-Purchase-URL: https://snapeda.com/shop?store=Mouser&id=433506; Package: SOIC-14 Texas Instruments; Texas_Instruments-Purchase-URL: https://snapeda.com/shop?store=Texas+Instruments&id=433506; Digi-Key_Part_Number: 296-1066-1-ND; Value: *; SnapEDA_Link: https://www.snapeda.com/parts/SN74ACT08DR/Texas%20Instruments/view-part/433506/?ref=snap; DigiKey-Purchase-URL: https://snapeda.com/shop?store=DigiKey&id=433506; MP: SN74ACT08DR; Arrow_Electronics-Purchase-URL: https://snapeda.com/shop?store=Arrow+Electronics&id=433506; Check_prices: https://www.snapeda.com/parts/SN74ACT08DR/Texas%20Instruments/view-part/433506/?ref=eda
U25 = AMS1117 SMD: Dán; Value: AMS1117-3.3V SOT223; Don_Vi: Con; Ma_Hang: MH000596; Ghi_Chu: *; Kieu_Chan: *; Chung_Loai: Dán
U6 U9 U11 U?#1 = LM339D: Price: None; Value: *; Package: None; Availability: Unavailable; MP: LM339D